# EAGLE design DrumMachine_Pic32_v1.2 (EAGLE 7.2.0)
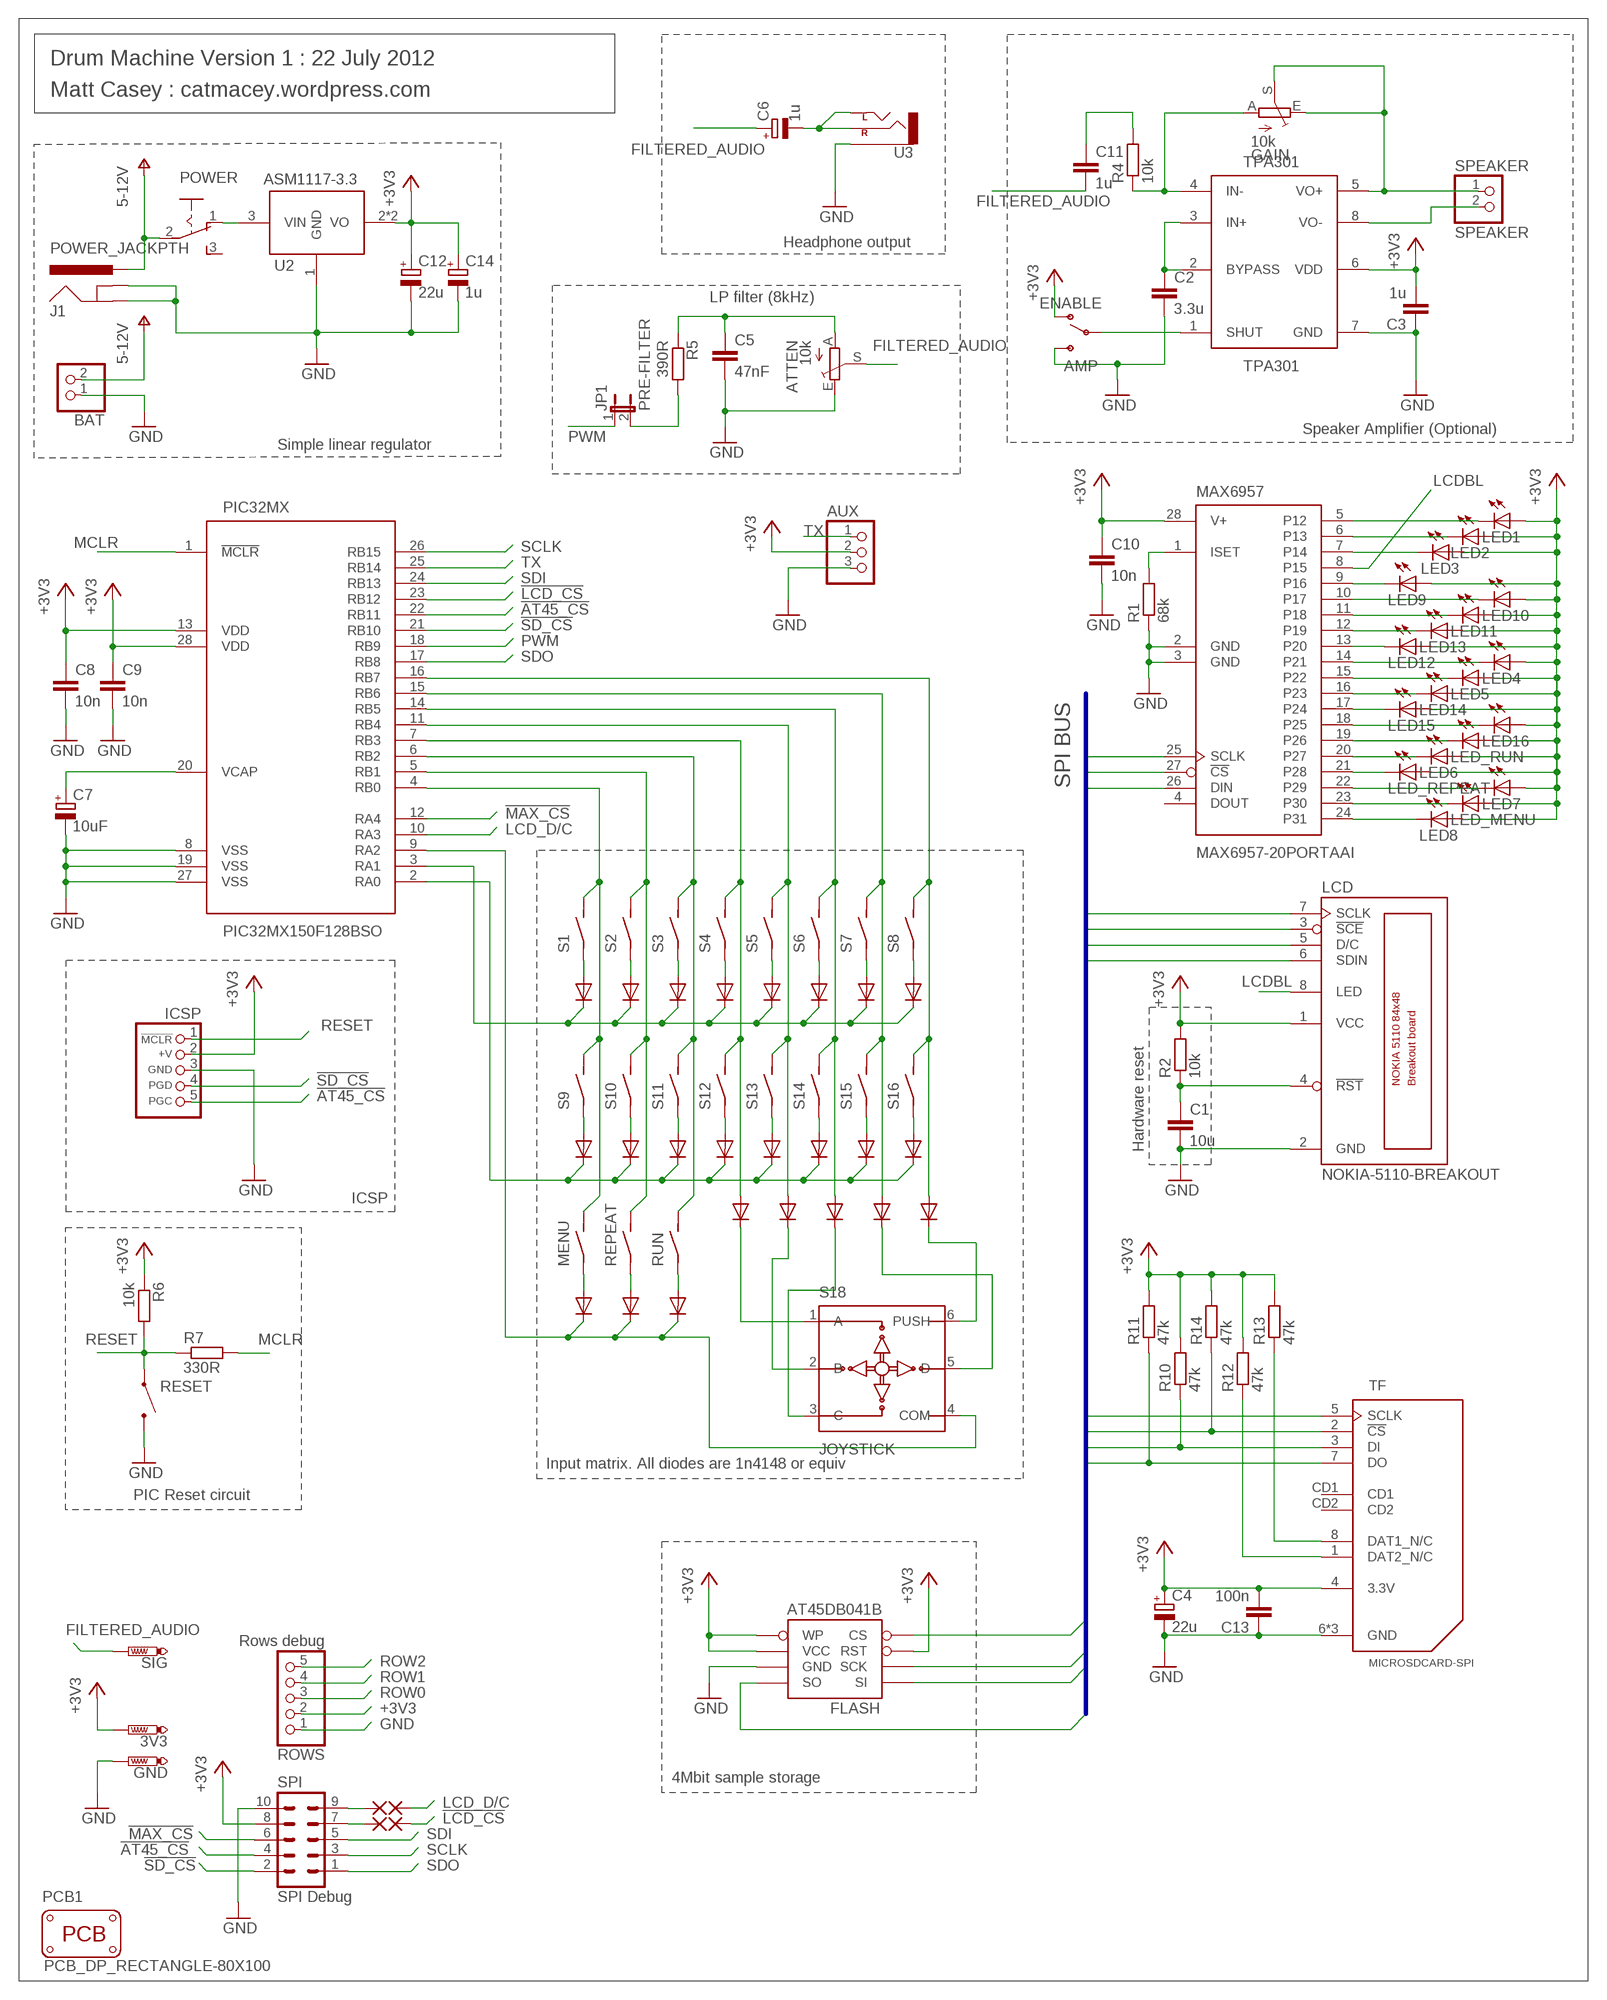
[diagram p0: schematic, sheet 1]

## Parts
3V3  PTR1PAD1-13  [P1-13]
AMP  ENABLE  SWITCH-SPST-SMD-A  [SWITCH-SPST-SMD-A]
ATTEN  10k  TRIM_EU-CA6V  [CA6V]
AUX  PINHD-1X3  [1X03]
BAT  PINHD-1X2  [1X02]
C1  10u  C-EUC0805  [C0805]
C2  3.3u  C-EUC0805  [C0805]
C3  1u  C-EUC0805  [C0805]
C4  22u  CPOL-EUSMCA  [SMC_A]
C5  47nF  C-EUC0805  [C0805]
C6  1u  CPOL-EU153CLV-0405  [153CLV-0405]
C7  10uF  CPOL-EUSMCA  [SMC_A]
C8  10n  C-EUC0805  [C0805]
C9  10n  C-EUC0805  [C0805]
C10  10n  C-EUC0805  [C0805]
C11  1u  C-EUC0805  [C0805]
C12  22u  CPOL-EUSMCA  [SMC_A]
C13  100n  C-EUC0805  [C0805]
C14  1u  CPOL-EU153CLV-0405  [153CLV-0405]
D1  DIODE-SOD-123  [SOD-123]
D2  DIODE-SOD-123  [SOD-123]
D3  DIODE-SOD-123  [SOD-123]
D4  DIODE-SOD-123  [SOD-123]
D5  DIODE-SOD-123  [SOD-123]
D6  DIODE-SOD-123  [SOD-123]
D7  DIODE-SOD-123  [SOD-123]
D8  DIODE-SOD-123  [SOD-123]
D9  DIODE-SOD-123  [SOD-123]
D10  DIODE-SOD-123  [SOD-123]
D11  DIODE-SOD-123  [SOD-123]
D12  DIODE-SOD-123  [SOD-123]
D13  DIODE-SOD-123  [SOD-123]
D14  DIODE-SOD-123  [SOD-123]
D15  DIODE-SOD-123  [SOD-123]
D16  DIODE-SOD-123  [SOD-123]
D17  DIODE-SOD-123  [SOD-123]
D18  DIODE-SOD-123  [SOD-123]
D19  DIODE-SOD-123  [SOD-123]
D20  DIODE-SOD-123  [SOD-123]
D21  DIODE-SOD-123  [SOD-123]
D22  DIODE-SOD-123  [SOD-123]
D23  DIODE-SOD-123  [SOD-123]
D25  DIODE-SOD-123  [SOD-123]
FLASH  AT45DB041B  [SO08]
GAIN  10k  TRIM_EU-CA6V  [CA6V]
GND  PTR1PAD1-13  [P1-13]
ICSP  CON_HEADER_PRG_PIC_ICSPB  [HEADER_PRG_1X05_ICSP_B]
J1  POWER_JACKPTH  [POWER_JACK_PTH]
JP1  PRE-FILTER  JP1E  [JP1]
LCD  NOKIA-5110-BREAKOUT  [NOKIA-5110-BREAKOUT]
LED1  LEDCHIPLED_0805  [CHIPLED_0805]
LED2  LEDCHIPLED_0805  [CHIPLED_0805]
LED3  LEDCHIPLED_0805  [CHIPLED_0805]
LED4  LEDCHIPLED_0805  [CHIPLED_0805]
LED5  LEDCHIPLED_0805  [CHIPLED_0805]
LED6  LEDCHIPLED_0805  [CHIPLED_0805]
LED7  LEDCHIPLED_0805  [CHIPLED_0805]
LED8  LEDCHIPLED_0805  [CHIPLED_0805]
LED9  LEDCHIPLED_0805  [CHIPLED_0805]
LED10  LEDCHIPLED_0805  [CHIPLED_0805]
LED11  LEDCHIPLED_0805  [CHIPLED_0805]
LED12  LEDCHIPLED_0805  [CHIPLED_0805]
LED13  LEDCHIPLED_0805  [CHIPLED_0805]
LED14  LEDCHIPLED_0805  [CHIPLED_0805]
LED15  LEDCHIPLED_0805  [CHIPLED_0805]
LED16  LEDCHIPLED_0805  [CHIPLED_0805]
LED_MENU  LEDCHIPLED_0805  [CHIPLED_0805]
LED_REPEAT  LEDCHIPLED_0805  [CHIPLED_0805]
LED_RUN  LEDCHIPLED_0805  [CHIPLED_0805]
MAX6957  MAX6957-20PORTAAI  [SSOP28]
MENU  ITT-PTS645SMD  [ITT-PTS645SMD]
P1  DEBUG_LCD_CS  1,6/0,81.2/0.5  [1,2/0,5]
P1A  LCD CS  1,6/0,81.2/0.5  [1,2/0,5]
P2  DEBUG_LCD_D/c  1,6/0,81.2/0.5  [1,2/0,5]
P2A  1,6/0,81.2/0.5  [1,2/0,5]
PCB1  PCB_DP_RECTANGLE-80X100  [DP10080_V1]
PIC32MX  PIC32MX150F128BSO  [SO-28]
POWER  DX_MINI_SPDT  [DX_MINI_SPDT_VERTICAL]
R1  68k  R-EU_R0805  [R0805]
R2  10k  R-EU_R0805  [R0805]
R4  10k  R-EU_R0805  [R0805]
R5  390R  R-EU_R0805  [R0805]
R6  10k  R-EU_R0805  [R0805]
R7  330R  R-EU_R0805  [R0805]
R10  47k  R-EU_R0805  [R0805]
R11  47k  R-EU_R0805  [R0805]
R12  47k  R-EU_R0805  [R0805]
R13  47k  R-EU_R0805  [R0805]
R14  47k  R-EU_R0805  [R0805]
REPEAT  ITT-PTS645SMD  [ITT-PTS645SMD]
RESET  TINY_TACTILESMD  [TINY_TACTILE_SMD]
ROWS  Rows debug  PINHD-1X5  [1X05]
RUN  ITT-PTS645SMD  [ITT-PTS645SMD]
S1  ITT-PTS645SMD  [ITT-PTS645SMD]
S2  ITT-PTS645SMD  [ITT-PTS645SMD]
S3  ITT-PTS645SMD  [ITT-PTS645SMD]
S4  ITT-PTS645SMD  [ITT-PTS645SMD]
S5  ITT-PTS645SMD  [ITT-PTS645SMD]
S6  ITT-PTS645SMD  [ITT-PTS645SMD]
S7  ITT-PTS645SMD  [ITT-PTS645SMD]
S8  ITT-PTS645SMD  [ITT-PTS645SMD]
S9  ITT-PTS645SMD  [ITT-PTS645SMD]
S10  ITT-PTS645SMD  [ITT-PTS645SMD]
S11  ITT-PTS645SMD  [ITT-PTS645SMD]
S12  ITT-PTS645SMD  [ITT-PTS645SMD]
S13  ITT-PTS645SMD  [ITT-PTS645SMD]
S14  ITT-PTS645SMD  [ITT-PTS645SMD]
S15  ITT-PTS645SMD  [ITT-PTS645SMD]
S16  ITT-PTS645SMD  [ITT-PTS645SMD]
S18  JOYSTICK  ALPS_SKQU_JOYSTICK  [ALPS_SKQU_JOYSTICK]
SIG  PTR1PAD1-13  [P1-13]
SPEAKER  SPEAKER  PINHD-1X2  [1X02]
SPI  SPI Debug  MA05-2  [MA05-2]
TF  MICROSDCARD-SPI  [TCF001_MICROSD_SOCKET]
TPA301  TPA301  [SO-08]
U2  ASM1117-3.3  [SOT223]
U3  AUDIO-JACKPTH  [STEREO_JACK3.5MM_PTH]

## Nets
!AT45_CS: FLASH.4(CS) ICSP.5(PGC) PIC32MX.22(RB11) SPI.4
!LCD_CS: LCD.3(!SCE) P1.1(P) P1A.1(P) PIC32MX.23(RB12) SPI.7
!LCDRST: C1.1 LCD.4(!RST) R2.1
!MAX_CS: MAX6957.27(!CS) PIC32MX.12(RA4) SPI.6
!SD_CS: ICSP.4(PGD) PIC32MX.21(RB10) R14.1 SPI.2 TF.2(!CS)
+3V3: 3V3.TP AMP.1(O) AUX.2 C3.2 C4.+ C8.1 C9.1 C10.1 C12.+ C13.2 C14.+ FLASH.3(RST) FLASH.5(WP) FLASH.6(VCC) ICSP.2(+V) LCD.1(VCC) LED1.A LED2.A LED3.A LED4.A LED5.A LED6.A LED7.A LED8.A LED9.A LED10.A LED11.A LED12.A LED13.A LED14.A LED15.A LED16.A LED_MENU.A LED_REPEAT.A LED_RUN.A MAX6957.28(V+) PIC32MX.13(VDD) PIC32MX.28(VDD) R2.2 R6.1 R10.2 R11.2 R12.2 R13.2 R14.2 ROWS.2 SPI.8 TF.4(3.3V) TPA301.6(VDD) U2.2(VO) U2.4(VO)
COL0: MENU.P$3 MENU.P$4 PIC32MX.4(RB0) S1.P$3 S1.P$4 S9.P$3 S9.P$4
COL1: PIC32MX.5(RB1) REPEAT.P$3 REPEAT.P$4 S2.P$3 S2.P$4 S10.P$3 S10.P$4
COL2: PIC32MX.6(RB2) RUN.P$3 RUN.P$4 S3.P$3 S3.P$4 S11.P$3 S11.P$4
COL3: D19.A PIC32MX.7(RB3) S4.P$3 S4.P$4 S12.P$3 S12.P$4
COL4: D20.A PIC32MX.11(RB4) S5.P$3 S5.P$4 S13.P$3 S13.P$4
COL5: D21.A PIC32MX.14(RB5) S6.P$3 S6.P$4 S14.P$3 S14.P$4
COL6: D22.A PIC32MX.15(RB6) S7.P$3 S7.P$4 S15.P$3 S15.P$4
COL7: D23.A PIC32MX.16(RB7) S8.P$3 S8.P$4 S16.P$3 S16.P$4
FILTERED_AUDIO: ATTEN.S C6.+ C11.2 SIG.TP
GND: AMP.3(S) ATTEN.E AUX.3 BAT.1 C1.2 C2.2 C3.1 C4.- C5.2 C7.- C8.2 C9.2 C10.2 C12.- C13.1 C14.- FLASH.7(GND) GND.TP ICSP.3(GND) J1.GND J1.GNDBREAK LCD.2(GND) MAX6957.2(GND) MAX6957.3(GND) PIC32MX.8(VSS) PIC32MX.19(VSS) PIC32MX.27(VSS) R1.1 RESET.2(B) ROWS.1 SPI.10 TF.6(GND) TF.P$11(GND) TF.P$12(GND) TPA301.7(GND) U2.1(GND) U3.S(SLEEVE) U3.S@1(SLEEVE)
LCD_D/C: LCD.5(D/C) P2.1(P) P2A.1(P) PIC32MX.10(RA3) SPI.9
LCDBL: LCD.8(LED) MAX6957.8(P15)
MCLR: PIC32MX.1(!MCLR) R7.2
N$1: D25.A S1.P$1 S1.P$2
N$2: D1.A S2.P$1 S2.P$2
N$3: D2.A S3.P$1 S3.P$2
N$4: D3.A S4.P$1 S4.P$2
N$5: D4.A S5.P$1 S5.P$2
N$6: D5.A S6.P$1 S6.P$2
N$7: D6.A S7.P$1 S7.P$2
N$8: D7.A S8.P$1 S8.P$2
N$9: LED1.C MAX6957.5(P12)
N$10: LED2.C MAX6957.6(P13)
N$11: LED3.C MAX6957.7(P14)
N$12: LED12.C MAX6957.13(P20)
N$13: LED11.C MAX6957.11(P18)
N$14: LED10.C MAX6957.10(P17)
N$15: LED9.C MAX6957.9(P16)
N$16: LED4.C MAX6957.14(P21)
N$17: LED13.C MAX6957.12(P19)
N$18: LED14.C MAX6957.16(P23)
N$19: LED15.C MAX6957.17(P24)
N$20: D18.A MENU.P$1 MENU.P$2
N$21: D17.A REPEAT.P$1 REPEAT.P$2
N$22: D16.A RUN.P$1 RUN.P$2
N$23: LED16.C MAX6957.18(P25)
N$24: D19.C S18.1(A)
N$25: D8.A S9.P$1 S9.P$2
N$26: LED5.C MAX6957.15(P22)
N$27: D9.A S10.P$1 S10.P$2
N$28: D10.A S11.P$1 S11.P$2
N$29: D11.A S12.P$1 S12.P$2
N$30: D12.A S13.P$1 S13.P$2
N$31: D13.A S14.P$1 S14.P$2
N$32: D14.A S15.P$1 S15.P$2
N$33: D15.A S16.P$1 S16.P$2
N$34: LED6.C MAX6957.20(P27)
N$35: D20.C S18.2(B)
N$36: D22.C S18.5(D)
N$37: D23.C S18.6(PUSH)
N$38: D21.C S18.3(C)
N$39: LED7.C MAX6957.22(P29)
N$40: LED8.C MAX6957.24(P31)
N$41: LED_RUN.C MAX6957.19(P26)
N$42: LED_REPEAT.C MAX6957.21(P28)
N$43: LED_MENU.C MAX6957.23(P30)
N$44: AMP.2(P) TPA301.1(SHUT)
N$45: MAX6957.1(ISET) R1.2
N$46: POWER.1(O) U2.3(VIN)
N$47: C2.1 TPA301.2(BYPASS) TPA301.3(IN+)
N$48: GAIN.E GAIN.S SPEAKER.1 TPA301.5(VO+)
N$49: C7.+ PIC32MX.20(VCAP)
N$50: GAIN.A R4.1 TPA301.4(IN-)
N$51: C11.1 R4.2
N$52: C6.- U3.L(LEFT) U3.L@1(LEFT) U3.R(RIGHT)
N$53: ATTEN.A C5.1 R5.1
N$55: R13.1 TF.8(DAT1_N/C)
N$59: R12.1 TF.1(DAT2_N/C)
N$60: SPEAKER.2 TPA301.8(VO-)
PWM: JP1.1 PIC32MX.18(RB9)
PWM2: JP1.2 R5.2
RESET: ICSP.1(/MCLR) R6.2 R7.1 RESET.1(A)
ROW0: D1.C D2.C D3.C D4.C D5.C D6.C D7.C D25.C PIC32MX.3(RA1) ROWS.3
ROW1: D8.C D9.C D10.C D11.C D12.C D13.C D14.C D15.C PIC32MX.2(RA0) ROWS.4
ROW2: D16.C D17.C D18.C PIC32MX.9(RA2) ROWS.5 S18.4(COM)
SCLK: FLASH.2(SCK) LCD.7(SCLK) MAX6957.25(SCLK) PIC32MX.26(RB15) SPI.3 TF.5(SCLK)
SDI: FLASH.8(SO) PIC32MX.24(RB13) R11.1 SPI.5 TF.7(DO)
SDO: FLASH.1(SI) LCD.6(SDIN) MAX6957.26(DIN) PIC32MX.17(RB8) R10.1 SPI.1 TF.3(DI)
TX: AUX.1 PIC32MX.25(RB14)
V+: BAT.2 J1.PWR POWER.2(P) ; supply symbol labelled 5-12V
Unconnected: MAX6957.4(DOUT) POWER.3(S) TF.CD1 TF.CD2

## Buses
SPI:SCLK,SDO,SDI,LCD_D/C,!LCD_CS,!MAX_CS,!SD_CS,!AT45_CS

## Notes on the sheet
- Drum Machine Version 1 : 22 July 2012
- Matt Casey : catmacey.wordpress.com
- Headphone output
- LP filter (8kHz)
- Speaker Amplifier (Optional)
- Simple linear regulator
- SPI BUS
- Hardware reset
- ICSP
- Input matrix. All diodes are 1n4148 or equiv
- PIC Reset circuit
- 4Mbit sample storage

## Library data of the parts
3V3 GND SIG = testpad:PTR1: TEST PIN
AMP = SparkFun:SWITCH-SPST: SPST Switch Simple slide switch. Spark Fun Electronics SKU : COM-00102
ATTEN GAIN = pot:TRIM_EU-: POTENTIOMETER
AUX = pinhead:PINHD-1X3: PIN HEADER
BAT SPEAKER = pinhead:PINHD-1X2: PIN HEADER
C1-C3 C5 C11 = rcl:C-EU: CAPACITOR, European symbol
C4 C6 C7 C12 C14 = rcl:CPOL-EU: POLARIZED CAPACITOR, European symbol
C8-C10 C13 = resistor:C-EU: CAPACITOR, European symbol
D1-D23 D25 = dp_devices:DIODE: Various Diode Packages
FLASH = SparkFun:AT45DB041B
ICSP = dp_devices:CON_HEADER_PRG_PIC_ICSP: 5-pin PIC In Circuit Serial Programming header
J1 = SparkFun:POWER_JACK: Power Jack This is the standard 5.5mm barrel jack for power. The PTH is the most common, proven, reliable, footprint. All others are experimental. The Slot footprint only works if the mill layer is transmitted to the PCB fab house so be warned. Spark Fun Electronics SKU : PRT-00119. Mating wall wart : TOL-00298 (and others)
JP1 = jumper:JP1E: JUMPER
LCD = Catmacey:NOKIA-5110-BREAKOUT
LED1-LED16 LED_MENU LED_REPEAT LED_RUN = led:LED: LED OSRAM: - CHIPLED LG R971, LG N971, LY N971, LG Q971, LY Q971, LO R971, LY R971 LH N974, LH R974 LS Q976, LO Q976, LY Q976 LO Q996 - Hyper CHIPLED LW Q18S LB Q993, LB Q99A, LB R99A - SideLED LS A670, LO A670, LY A670, LG A670, LP A670 LB A673, LV A673, LT A673, LW A673 LH A674 LY A675 LS A676, LA A676, LO A676, LY A676, LW A676 LS A679, LY A679, LG A679 - Hyper Micro SIDELED® LS Y876, LA Y876, LO Y876, LY Y876 LT Y87S - SmartLED LW L88C, LW L88S LB L89C, LB L89S, LG L890 LS L89K, LO L89K, LY L89K LS L896, LA L896, LO L896, LY L896 - TOPLED LS T670, LO T670, LY T670, LG T670, LP T670 LSG T670, LSP T670, LSY T670, LOP T670, LYG T670 LG T671, LOG T671, LSG T671 LB T673, LV T673, LT T673, LW T673 LH T674 LS T676, LA T676, LO T676, LY T676, LB T676, LH T676, LSB T676, LW T676 LB T67C, LV T67C, LT T67C, LS T67K, LO T67K, LY T67K, LW E67C LS E67B, LA E67B, LO E67B, LY E67B, LB E67C, LV E67C, LT E67C LW T67C LS T679, LY T679, LG T679 LS T770, LO T770, LY T770, LG T770, LP T770 LB T773, LV T773, LT T773, LW T773 LH T774 LS E675, LA E675, LY E675, LS T675 LS T776, LA T776, LO T776, LY T776, LB T776 LHGB T686 LT T68C, LB T68C - Hyper Mini TOPLED® LB M676 - Mini TOPLED Santana® LG M470 LS M47K, LO M47K, LY M47K Source: http://www.osram.convergy.de LUXEON: - LUMILED® LXK2-PW12-R00, LXK2-PW12-S00, LXK2-PW14-U00, LXK2-PW14-V00 LXK2-PM12-R00, LXK2-PM12-S00, LXK2-PM14-U00 LXK2-PE12-Q00, LXK2-PE12-R00, LXK2-PE12-S00, LXK2-PE14-T00, LXK2-PE14-U00 LXK2-PB12-K00, LXK2-PB12-L00, LXK2-PB12-M00, LXK2-PB14-N00, LXK2-PB14-P00, LXK2-PB14-Q00 LXK2-PR12-L00, LXK2-PR12-M00, LXK2-PR14-Q00, LXK2-PR14-R00 LXK2-PD12-Q00, LXK2-PD12-R00, LXK2-PD12-S00 LXK2-PH12-R00, LXK2-PH12-S00 LXK2-PL12-P00, LXK2-PL12-Q00, LXK2-PL12-R00 Source: www.luxeon.com KINGBRIGHT: KA-3528ASYC Source: www.kingbright.com
MAX6957 = Catmacey:MAX6957-20PORT: The MAX6957 <http://www.maxim-ic.com/datasheet/index.mvp/id/3365> is a compact, 4-wire (SPI) interfaced LED display driver general-purpose I/O (GPIO) peripheral provides microprocessors with up to 28 ports. Each port is individually user configurable to either a logic input, logic output, or common-anode (CA) LED constant-current segment driver. Each port configured as an LED segment driver behaves as a digitally controlled constantcurrent sink, with 16 equal current steps from 1.5mA to 24mA. The LED drivers are suitable for both discrete LEDs and CA numeric and alphanumeric LED digits. Each port configured as a GPIO can be either a push-pull logic output capable of sinking 10mA and sourcing 4.5mA, or a Schmitt logic input with optional internal pullup. Seven ports feature configurable transition detection logic, which generates an interrupt upon change of port logic level. The MAX6957 is controlled through an SPI™-compatible 4-wire serial interface. The MAX6957AAX and MAX6957ATL have 28 ports and are available in 36-pin SSOP and 40-pin TQFN (6mm x 6mm) packages, respectively. The MAX6957AAI and MAX6957ANI have 20 ports and are available in 28-pin SSOP and 28-pin DIP packages, respectively. For a 2-wire interfaced version, refer to the MAX6956 data sheet. For a lower cost pin-compatible port expander without the constant-current LED drive capability, refer to the MAX7301 data sheet. Key features High-Speed 26MHz SPI-/QSPI-™/MICROWIRE™-Compatible Serial Interface 2.5V to 5.5V Operation -40°C to +125°C Temperature Range 20 or 28 I/O Ports, Each Configurable as Constant-Current LED Driver Push-Pull Logic Output Schmitt Logic Input Schmitt Logic Input with Internal Pullup 11µA (max) Shutdown Current 16-Step Individually Programmable Current Control for Each LED Logic Transition Detection for Seven I/O Ports Underwriters Laboratories (UL) Recognized </qa/info/ul/>
MENU REPEAT RUN S1-S16 = Catmacey:ITT-PTS645: ITT SWITCH
P1 P1A P2 P2A = wirepad:1,6/0,8: THROUGH-HOLE PAD
PCB1 = dp_devices:PCB_DP_RECTANGLE: Dangerous Prototypes Standard Rectangular PCB sizes
PIC32MX = Catmacey:PIC32MX150F128B
POWER = Catmacey:DX_MINI_SPDT: SLIDING SWITCH SPDT Odd pin spacing 4.8mm bought from Deal Extreme Here <http://dx.com/p/3-pin-slide-switch-diy-parts-black-silver-20-piece-pack-134100?item=276>
R1 R2 R4-R7 R10-R14 = resistor:R-EU_: RESISTOR, European symbol
RESET = Catmacey:TINY_TACTILE: DIL/CODE SWITCH
ROWS = pinhead:PINHD-1X5: PIN HEADER
S18 = Catmacey:ALPS_SKQU_JOYSTICK: 4 way mini joystick with center push button ALPS Info page <http://www.alps.com/products/WebObjects/catalog.woa/E/HTML/Switch/Tact/SKQU/SKQUCAA010.html>
SPI = con-lstb:MA05-2: PIN HEADER; OC_FARNELL: unknown; OC_NEWARK: unknown
TF = Catmacey:MICROSDCARD-SPI
TPA301 = Catmacey:TPA301: TPA301 350-mW Mono Class-AB Audio Amplifier Info <http://www.ti.com/product/tpa301> The TPA301 is a bridge-tied load (BTL) audio power amplifier developed especially for low-voltage applications where internal speakers are required. Operating with a 3.3-V supply, the TPA301 can deliver 250-mW of continuous power into a BTL 8- load at less than 1% THD+N throughout voice band frequencies. Although this device is characterized out to 20 kHz, its operation was optimized for narrower band applications such as cellular communications. The BTL configuration eliminates the need for external coupling capacitors on the output in most applications, which is particularly important for small battery-powered equipment. This device features a shutdown mode for power-sensitive applications with a quiescent current of 0.15 µA during shutdown. The TPA301 is available in an 8-pin SOIC surface-mount package and the surface-mount PowerPAD MSOP, which reduces board space by 50% and height by 40%.
U2 = Catmacey:ASM1117-3.3: ICP006
U3 = Catmacey:AUDIO-JACK: 3.5mm Audio Jack Simple 3.5mm common PCB mount audio jack. SKU: PRT-08032

## Board
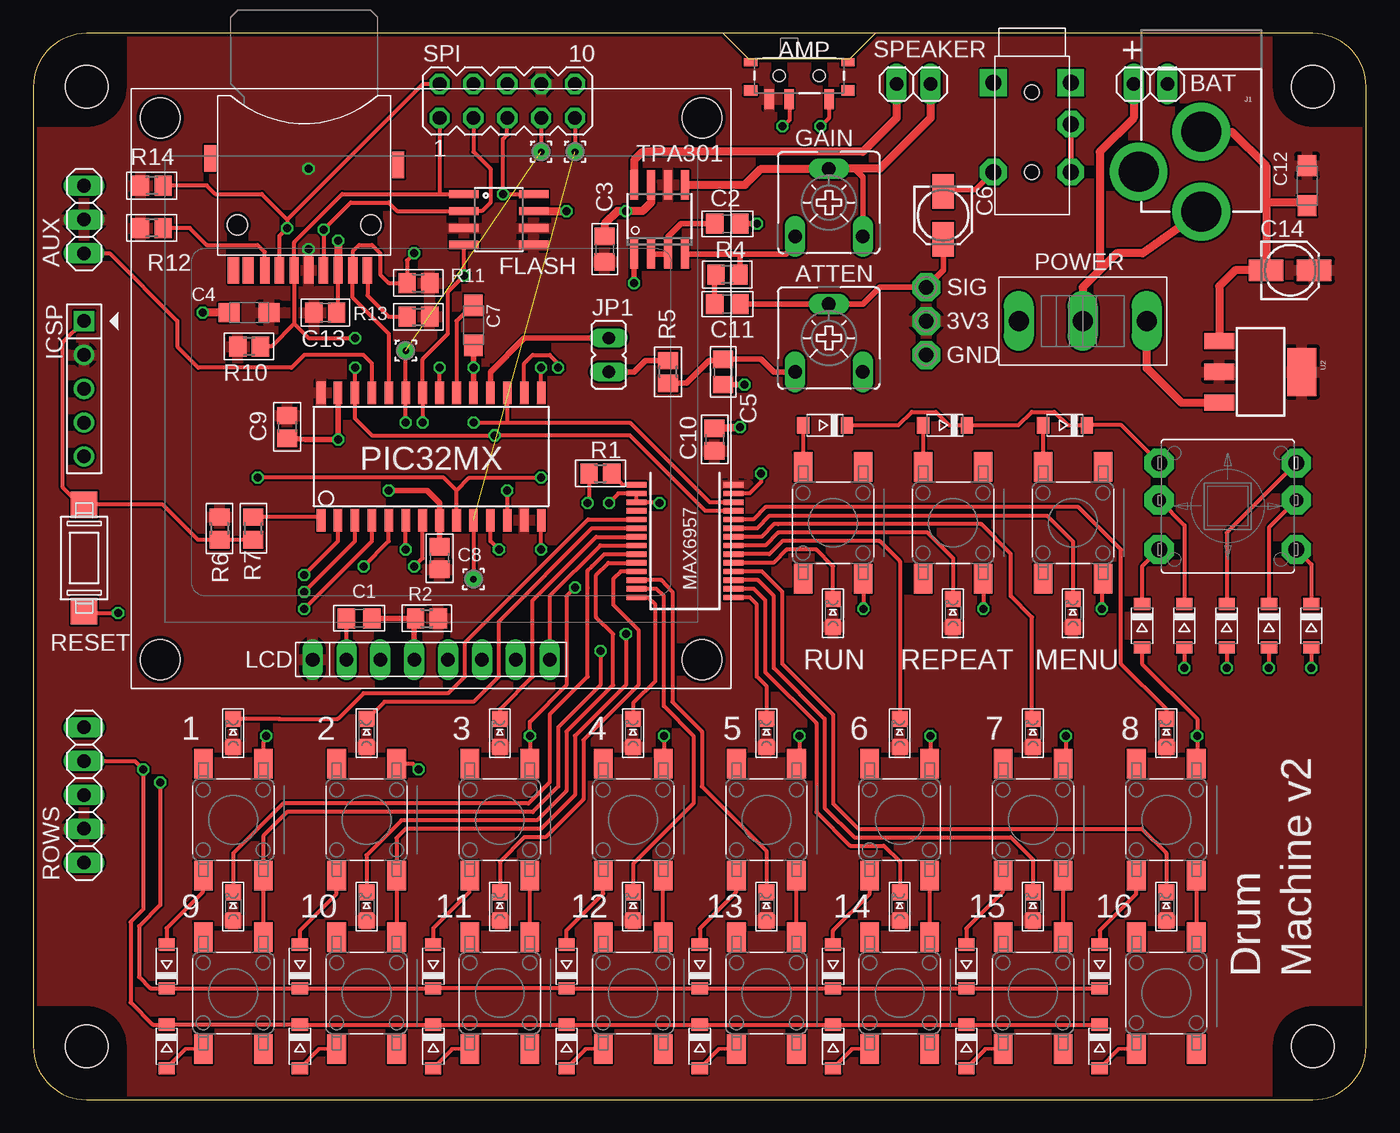
[diagram p1: board, top side]
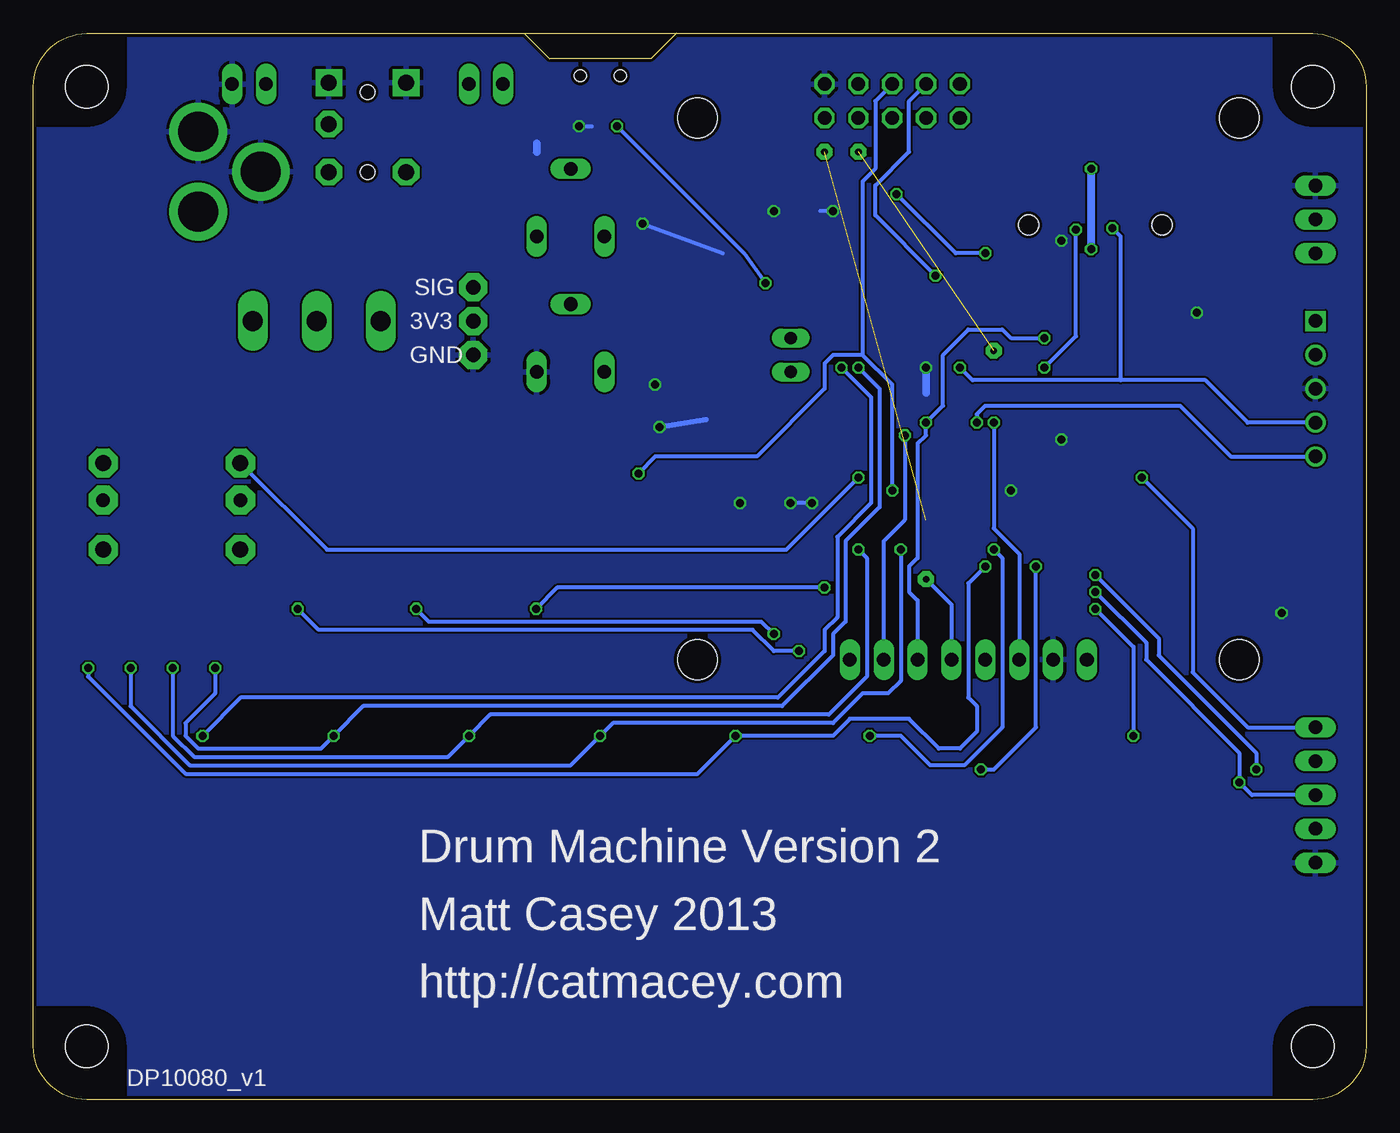
[diagram p2: board, bottom side, seen from below]

Size 100 x 80.01 mm. Coordinates in mm from the lower left corner, seen from the top.
Outline: 51.75,80.01 53.66,78.11 61.28,78.11 63.18,80.01
Copper layers (1*16): Top 0.035mm / dielectric 1.5mm / Bottom 0.035mm
Design rules "default": minimum track width 6mil, minimum drill 12mil, track to track 6mil, track to pad 6mil, pad to pad 6mil, via to via 6mil, smd to smd 0mil, copper to edge 10mil, drill to drill 10mil, minimum pad ring 10mil, minimum via ring 6mil, stop-mask expansion 2mil, vias tented up to drill 100mil, thermal gap 10mil

### Footprints (pad centres in the part's own frame; a part is rotated, then mirrored left to right if it is on the bottom)
P1-13 = drill 1.1 pad 2.1 octagon: TP 0,0
SWITCH-SPST-SMD-A = smd 0.7 x 1.5: 1 -2.25,-1.75; 2 -0.75,-1.75; 3 2.25,-1.75 | smd 1 x 0.6: GND1 -3.65,1; GND3 3.65,1 | smd 1 x 0.8: GND2 -3.65,-1.1; GND4 3.65,-1.1 | hole 0.9: -1.5,0; 1.5,0
CA6V = drill 1.016 long: A -2.54,-2.54; E 2.54,-2.54; S 0,2.54
1X03 = drill 1.016 long: 1 -2.54,0; 2 0,0; 3 2.54,0
1X02 = drill 1.016 long: 1 -1.27,0; 2 1.27,0
C0805 = smd 1.3 x 1.5: 1 -0.95,0; 2 0.95,0
SMC_A = smd 1.6 x 1.4: + -1.5,0; - 1.5,0
153CLV-0405 = smd 2.6 x 1.6: + 1.8,0; - -1.8,0
C0805' = smd 1.3 x 1.5: 1 -0.85,0; 2 0.85,0
SOD-123 = smd 0.91 x 1.22: A 1.635,0; C -1.635,0
SO08 = smd 0.61 x 2.21: 1 -1.905,-2.616; 2 -0.635,-2.616; 3 0.635,-2.616; 4 1.905,-2.616; 5 1.905,2.616; 6 0.635,2.616; 7 -0.635,2.616; 8 -1.905,2.616
HEADER_PRG_1X05_ICSP_B = drill 1.016 square: 1 -5.08,0 | drill 1.016: 2 -2.54,0; 3 0,0; 4 2.54,0; 5 5.08,0
POWER_JACK_PTH = drill 2.997 pad 4.318: GND 0,7.7; GNDBREAK 4.7,10.7; PWR 0,13.7
JP1 = drill 0.914 long: 1 0,-1.27; 2 0,1.27
NOKIA-5110-BREAKOUT = drill 1.016 long: 1 0,0; 2 2.54,0; 3 5.08,0; 4 7.62,0; 5 10.16,0; 6 12.7,0; 7 15.24,0; 8 17.78,0 | hole 3: -11.43,40.64; 29.21,40.64; -11.43,0; 29.21,0
CHIPLED_0805 = smd 1.2 x 1.2: A 0,-1.05; C 0,1.05
SSOP28 = smd 0.4 x 1.5: 1 -4.225,-3.625; 2 -3.575,-3.625; 3 -2.925,-3.625; 4 -2.275,-3.625; 5 -1.625,-3.625; 6 -0.975,-3.625; 7 -0.325,-3.625; 8 0.325,-3.625; 9 0.975,-3.625; 10 1.625,-3.625; 11 2.275,-3.625; 12 2.925,-3.625; 13 3.575,-3.625; 14 4.225,-3.625; 15 4.225,3.625; 16 3.575,3.625; 17 2.925,3.625; 18 2.275,3.625; 19 1.625,3.625; 20 0.975,3.625; 21 0.325,3.625; 22 -0.325,3.625; 23 -0.975,3.625; 24 -1.625,3.625; 25 -2.275,3.625; 26 -2.925,3.625; 27 -3.575,3.625; 28 -4.225,3.625
ITT-PTS645SMD = smd 2.2 x 1.4: P$1 -4.2,2.25; P$2 4.2,2.25; P$3 -4.2,-2.25; P$4 4.2,-2.25
1,2/0,5 = drill 0.5 pad 1.2 octagon: 1 0,0
DP10080_V1 = hole 3.2: 4,4; 96,4; 96,76; 4,76
SO-28 = smd 0.65 x 1.7: 1 -8.89,-4.78; 2 -7.62,-4.78; 3 -6.35,-4.78; 4 -5.08,-4.78; 5 -3.81,-4.78; 6 -2.54,-4.78; 7 -1.27,-4.78; 8 0,-4.78; 9 1.27,-4.78; 10 2.54,-4.78; 11 3.81,-4.78; 12 5.08,-4.78; 13 6.35,-4.78; 14 7.62,-4.78; 15 7.62,4.78; 16 6.35,4.78; 17 5.08,4.78; 18 3.81,4.78; 19 2.54,4.78; 20 1.27,4.78; 21 0,4.78; 22 -1.27,4.78; 23 -2.54,4.78; 24 -3.81,4.78; 25 -5.08,4.78; 26 -6.35,4.78; 27 -7.62,4.78; 28 -8.89,4.78
DX_MINI_SPDT_VERTICAL = drill 1.5 long: 1 -4.8,0; 2 0,0; 3 4.8,0
R0805 = smd 1.3 x 1.5: 1 -0.85,0; 2 0.85,0
TINY_TACTILE_SMD = smd 2 x 2: 1 0,4; 2 0,-4
1X05 = drill 1.016 long: 1 -5.08,0; 2 -2.54,0; 3 0,0; 4 2.54,0; 5 5.08,0
ALPS_SKQU_JOYSTICK = drill 1.2 pad 2.184 octagon: 1 -0.15,8.25; 3 -0.15,1.75; 4 10.15,1.75; 6 10.15,8.25 | drill 1 pad 2.184 octagon: 2 -0.15,4.55; 5 10.15,4.55
MA05-2 = drill 1.016 octagon: 1 -5.08,-1.27; 2 -5.08,1.27; 3 -2.54,-1.27; 4 -2.54,1.27; 5 0,-1.27; 6 0,1.27; 7 2.54,-1.27; 8 2.54,1.27; 9 5.08,-1.27; 10 5.08,1.27
TCF001_MICROSD_SOCKET = smd 0.7 x 2: 1 2.95,6.35; 2 1.85,6.35; 3 0.75,6.35; 4 -0.35,6.35; 5 -1.45,6.35; 6 -2.55,6.35; 7 -3.65,6.35; 8 -4.75,6.35 | smd 0.85 x 2: CD1 4.2,6.35; CD2 5.3,6.35 | smd 0.9 x 2: P$11 -7.05,-1.55; P$12 7.05,-2.05 | hole 1.5: -5,2.95; 5,2.95
SO-08 = smd 0.6 x 2.2: 1 -1.905,-2.6; 2 -0.635,-2.6; 3 0.635,-2.6; 4 1.905,-2.6; 5 1.905,2.6; 6 0.635,2.6; 7 -0.635,2.6; 8 -1.905,2.6
SOT223 = smd 1.219 x 2.235: 1 -2.311,-3.099; 2 0,-3.099; 3 2.311,-3.099 | smd 3.6 x 2.2: 4 0,3.099
STEREO_JACK3.5MM_PTH = drill 1.2 pad 2 octagon: L -2.9,-6.6; L@1 2.9,-6.6; R 2.9,-3 | drill 1.2 pad 2 square: S -2.9,0.1; S@1 2.9,0.1 | hole 1.1: 0,-6.6; 0,-0.6

### Placement (x,y rotation side)
3V3  66.99,58.42 0 top
AMP  57.47,76.83 0 top
ATTEN  59.69,57.15 0 top
AUX  3.81,66.04 90 top
BAT  83.82,76.2 180 top
C1  24.45,36.12 180 top
C2  52.07,65.72 0 top
C3  42.86,63.82 270 top
C4  16.19,59.05 180 top
C5  51.75,54.61 270 top
C6  68.26,66.36 270 top
C7  33.02,58.1 270 top
C8  10n  [C0805']  30.48,40.64 90 top
C9  10n  [C0805']  19.05,50.48 270 top
C10  10n  [C0805']  51.12,49.53 90 top
C11  52.07,59.69 0 top
C12  95.57,68.58 270 top
C13  100n  [C0805']  21.91,59.05 180 top
C14  94.3,62.23 0 top
D1  20,10 90 top
D2  30,10 90 top
D3  40,10 90 top
D4  50,10 90 top
D5  60,10 90 top
D6  70,10 90 top
D7  80,10 90 top
D8  10,4 270 top
D9  20,4 270 top
D10  30,4 270 top
D11  40,4 270 top
D12  50,4 270 top
D13  60,4 270 top
D14  70,4 270 top
D15  80,4 270 top
D16  59.4,50.6 180 top
D17  68.4,50.6 180 top
D18  77.4,50.6 180 top
D19  95.89,35.56 270 top
D20  92.71,35.56 270 top
D21  89.53,35.56 270 top
D22  86.36,35.56 270 top
D23  83.19,35.56 270 top
D25  10,10 90 top
FLASH  34.92,66.04 270 top
GAIN  59.69,67.31 0 top
GND  66.99,55.88 0 top
ICSP  3.81,53.34 270 top
J1  87.63,80.33 180 top
JP1  43.18,55.88 180 top
LCD  20.95,33.02 0 top
LED1  15,27.5 0 top
LED2  25,27.5 0 top
LED3  35,27.5 0 top
LED4  45,27.5 0 top
LED5  55,27.5 0 top
LED6  65,27.5 0 top
LED7  75,27.5 0 top
LED8  85,27.5 0 top
LED9  15,14.5 0 top
LED10  25,14.5 0 top
LED11  35,14.5 0 top
LED12  45,14.5 0 top
LED13  55,14.5 0 top
LED14  65,14.5 0 top
LED15  75,14.5 0 top
LED16  85,14.5 0 top
LED_MENU  78,36.5 0 top
LED_REPEAT  69,36.5 0 top
LED_RUN  60,36.5 0 top
MAX6957  48.9,41.91 270 top
MENU  78,43.28 90 top
P1  38.1,71.12 0 top
P1A  27.94,56.2 0 top
P2  40.64,71.12 0 top
P2A  33.02,39.05 0 top
PCB1  0,0 0 top
PIC32MX  30.48,48.26 0 top
POWER  78.74,58.42 180 top
R1  42.55,46.99 0 top
R2  29.53,36.12 0 top
R4  52.07,61.91 180 top
R5  47.62,54.61 90 top
R6  13.97,42.86 270 top
R7  16.51,42.86 90 top
R10  16.19,56.52 180 top
R11  28.89,61.28 0 top
R12  8.89,65.41 180 top
R13  28.89,58.74 0 top
R14  8.89,68.58 180 top
REPEAT  69,43.28 90 top
RESET  3.81,40.64 0 top
ROWS  3.81,22.86 90 top
RUN  60,43.28 90 top
S1  15,21 90 top
S2  25,21 90 top
S3  35,21 90 top
S4  45,21 90 top
S5  55,21 90 top
S6  65,21 90 top
S7  75,21 90 top
S8  85,21 90 top
S9  15,8 90 top
S10  25,8 90 top
S11  35,8 90 top
S12  45,8 90 top
S13  55,8 90 top
S14  65,8 90 top
S15  75,8 90 top
S16  85,8 90 top
S18  94.61,49.53 180 top
SIG  66.99,60.96 0 top
SPEAKER  66.04,76.2 180 top
SPI  35.56,74.93 0 top
TF  20.32,68.58 180 top
TPA301  46.99,66.04 0 top
U2  92.08,54.61 270 top
U3  74.93,76.2 0 top

### Tracks (layer width: path | path; a pad name or v marks a point on that pad's centre or on a via)
!AT45_CS  (via drill 0.6)
  Top 0.305: FLASH.4 v32.31,61.84 31.11,60.64 31.11,57.47 29.21,55.56 PIC32MX.22 v29.21,50.8
  Bottom 0.305: SPI.4 34.29,74.93 34.29,71.12 36.83,68.58 36.83,66.36 v32.31,61.84 | ICSP.5 10.16,48.26 13.97,52.07 28.57,52.07 29.21,51.44 v29.21,50.8
!LCD_CS  (via drill 0.6)  (1 unrouted)
  Top 0.305: v27.94,50.8 PIC32MX.23 P1A.1 | SPI.7 P1.1
  Bottom 0.305: v27.94,50.8 27.94,42.86 26.04,40.96 LCD.3
!LCDRST
  Top 0.406: LCD.4 28.57,36.12 | 28.57,36.12 R2.1 | 28.57,36.12 C1.1
!MAX_CS  (via drill 0.6)
  Top 0.305: v35.56,45.72 PIC32MX.12 | MAX6957.27 53.74,45.48 54.61,46.35 v54.61,46.99
  Bottom 0.305: v35.56,45.72 35.56,53.66 37.78,55.88 | 37.78,55.88 40.01,55.88 40.64,55.24 40.64,53.34 45.72,48.26 53.34,48.26 v54.61,46.99 | SPI.6 36.83,74.93 36.83,69.85 37.78,68.9 37.78,55.88
!SD_CS  (via drill 0.6)
  Top 0.305: R14.1 13.02,68.58 13.65,67.94 17.14,67.94 19.05,66.04 | PIC32MX.21 v30.48,54.93 | TF.2 18.47,64.83 v19.05,65.41 19.05,66.04 | SPI.2 29.21,76.2 19.05,66.04
  Bottom 0.305: v30.48,54.93 29.53,53.98 18.41,53.98 | v19.05,65.41 18.41,64.77 18.41,53.98 | ICSP.4 8.89,50.8 12.06,53.98 18.41,53.98
+3V3  (via drill 0.6)
  Top 0.61: TF.4 20.64,62.2 v20.64,63.82
  Bottom 0.61: v20.64,63.82 v20.64,69.85
  pour Top: 0,80.01 0,0 100.33,0 100.33,80.01
COL0  (via drill 0.6)
  Top 0.305: S9.P$4 S1.P$3 17.25,19.79 19.05,21.59 37.47,21.59 39.37,23.5 39.37,27.94 42.55,31.11 v42.55,33.66 | v20.32,36.83 25.4,41.91 PIC32MX.4 | 17.33,25.08 S1.P$4 17.25,26.77 v17.46,27.3 | MENU.P$3 80.18,39.21 v80.18,36.84
  Bottom 0.305: v20.32,36.83 17.46,33.97 v17.46,27.3 | v42.55,33.66 44.45,33.66 46.04,35.24 78.58,35.24 v80.18,36.84
COL1  (via drill 0.6)
  Top 0.305: S10.P$4 S2.P$3 27.25,19.63 27.94,20.32 38.1,20.32 40.64,22.86 40.64,27.3 44.45,31.11 v44.45,34.92 | v24.77,40.01 26.67,41.91 PIC32MX.5 | REPEAT.P$3 71.29,39.24 v71.29,36.84 | v28.89,24.77 28.46,25.2 S2.P$4
  Bottom 0.305: v28.89,24.77 27.94,24.77 24.77,27.94 v24.77,40.01 | v44.45,34.92 45.4,35.88 70.33,35.88 v71.29,36.84
COL2  (via drill 0.6)
  Top 0.305: S11.P$4 S3.P$3 | v40.64,38.42 40.01,37.78 40.01,31.11 37.25,28.36 v37.25,27.3 S3.P$4 37.25,24.45 36.93,24.45 | RUN.P$3 62.27,39.26 v62.27,36.84 | v27.94,41.27 PIC32MX.6
  Bottom 0.305: v27.94,41.27 27.3,40.64 27.3,27.94 30.16,25.08 32.7,25.08 34.92,27.3 v37.25,27.3 | v40.64,38.42 60.69,38.42 v62.27,36.84
COL3  (via drill 0.6)
  Top 0.305: S12.P$4 S4.P$3 | v28.57,40.01 29.21,40.64 PIC32MX.7 | v47.31,27.3 47.31,25.06 S4.P$4 | D19.A v95.89,32.38
  Bottom 0.305: v28.57,40.01 29.84,38.73 29.84,30.16 29.21,29.53 29.21,27.62 30.48,26.35 32.07,26.35 34.29,28.57 38.73,28.57 40.01,27.3 v47.31,27.3 50.16,24.45 88.58,24.45 95.89,31.75 v95.89,32.38
COL4  (via drill 0.6)
  Top 0.305: S13.P$4 S5.P$3 | v34.92,41.27 34.29,41.91 PIC32MX.11 | v57.47,27.3 57.47,25.22 S5.P$4 | D20.A v92.71,32.38
  Bottom 0.305: v34.92,41.27 34.92,31.43 35.88,30.48 37.78,30.48 40.01,28.26 56.52,28.26 v57.47,27.3 59.69,25.08 88.27,25.08 92.71,29.53 v92.71,32.38
COL5  (via drill 0.6)
  Top 0.305: S14.P$4 S6.P$3 | v67.31,27.3 67.31,25.06 S6.P$4 | D21.A v89.53,32.38 | v38.1,41.27 PIC32MX.14
  Bottom 0.305: v38.1,41.27 37.47,40.64 37.47,31.75 40.32,28.89 65.72,28.89 v67.31,27.3 68.9,25.72 87.95,25.72 89.53,27.3 v89.53,32.38
COL6  (via drill 0.6)
  Top 0.305: S7.P$3 S15.P$4 | 77.25,24.35 S7.P$4 77.47,25.22 v77.47,27.3 | D22.A v86.36,32.38 | PIC32MX.15 v38.1,54.93
  Bottom 0.305: v38.1,54.93 36.51,53.34 36.51,44.45 39.05,41.91 39.05,35.88 40.01,34.92 40.01,33.34 43.81,29.53 75.25,29.53 v77.47,27.3 78.42,26.35 87.63,26.35 88.58,27.3 88.58,28.26 86.36,30.48 v86.36,32.38
COL7  (via drill 0.6)
  Top 0.305: S8.P$3 S16.P$4 | v39.37,54.93 39.37,55.24 38.73,55.88 37.47,55.88 36.83,55.24 PIC32MX.16 | 87.25,25.02 S8.P$4 | S8.P$4 87.13,24.9 | S8.P$4 87.31,25.06 v87.31,27.3 87.31,28.57 83.19,32.7 D23.A
  Bottom 0.305: v39.37,54.93 37.15,52.7 37.15,44.77 39.69,42.23 39.69,36.2 40.64,35.24 40.64,33.66 44.13,30.16 84.45,30.16 v87.31,27.3
FILTERED_AUDIO
  Top 0.406: C11.2 ATTEN.S 62.23,59.69 63.5,60.96 SIG.TP 68.26,62.23 C6.+
GND  (via drill 0.6)
  Top 0.305: 22.77,62.13 TF.6 22.87,59.17 C13.1 | v43.18,44.77 43.9,45.48 MAX6957.2 MAX6957.3 46.99,44.84 v46.99,44.77 | R1.1 41.7,44.87 v41.59,44.77 | LCD.2 23.5,35.56 23.41,35.48 C1.2 | RESET.2 3.94,36.51 v6.35,36.51 | AMP.3 59.69,75.06 59.69,73.66 v59.05,73.03
  Top 0.406: C9.2 20.42,49.53 v22.86,49.53 PIC32MX.27 | v54.29,65.72 C2.2 | C5.2 v53.34,53.66 | C8.2 PIC32MX.8 30.48,44.77 29.53,45.72 v26.67,45.72 | C7.- v33.02,54.93 PIC32MX.19
  Top 0.61: TPA301.7 46.35,67.31 45.72,66.67 v44.45,66.67 43.81,66.67 42.86,65.72 C3.1 | FLASH.7 v40.01,66.67 | C4.- v12.7,59.05 | v22.86,64.45 v22.87,64.44 TF.6 | C10.2 v53.02,50.48 | J1.GND 89.93,72.63 92.5,70.06 92.5,67.31 | 92.5,67.31 C14.- 90.17,62.23 88.98,61.04 U2.1 | 95.34,67.31 92.5,67.31
  Top 0.813: C12.- 95.34,67.31
  Bottom 0.305: v54.29,65.72 48.26,63.5 | v40.01,66.67 40.96,66.67 | v41.59,44.77 42.86,44.77 43.18,44.45 | v59.05,73.03 58.1,73.03
  Bottom 0.406: v53.02,50.48 49.53,51.02
  Bottom 0.61: 62.23,71.75 62.23,71.12 | v33.02,54.93 PIC32MX.19
  pour Bottom: 0,80.01 99.69,80.01 99.69,0 0,0
LCD_D/C  (1 unrouted)
  Top 0.305: PIC32MX.10 P2A.1 | SPI.9 P2.1
  Bottom 0.305: P2A.1 31.11,37.15 LCD.5
LCDBL
  Top 0.305: LCD.8 38.73,37.78 42.54,41.59 MAX6957.8
MCLR
  Top 0.305: R7.2 21.59,43.71 PIC32MX.1
N$1
  Top 0.305: S1.P$1 12.7,17.05 12.7,15.56 10,12.86 D25.A
N$2
  Top 0.305: D1.A 20,12.7 22.75,15.45 S2.P$1
N$3
  Top 0.305: S3.P$1 32.7,17.05 32.7,15.56 30,12.86 D2.A
N$4
  Top 0.305: D3.A 40.01,12.7 42.75,15.45 S4.P$1
N$5
  Top 0.305: S5.P$1 52.7,17.05 52.7,15.56 50,12.85 D4.A
N$6
  Top 0.305: D5.A 60.01,11.64 60.01,12.7 62.75,15.44 S6.P$1
N$7
  Top 0.305: S7.P$1 72.71,17.06 72.71,15.56 70,12.85 D6.A
N$8
  Top 0.305: 82.55,16.9 S8.P$1 82.75,15.44 80,12.69 D7.A
N$9
  Top 0.305: 14.9,28.55 LED1.C 18.44,28.55 18.46,28.57 22.86,28.57 24.77,30.48 31.11,30.48 32.38,31.75 32.38,34.29 41.63,43.53 MAX6957.5
N$10
  Top 0.305: LED2.C 25.06,28.55 26.35,29.84 33.02,29.84 34.92,31.75 34.92,35.88 41.93,42.88 MAX6957.6
N$11
  Top 0.305: MAX6957.7 42.22,42.22 37.47,37.47 37.47,31.75 35,29.29 LED3.C 35.02,28.57
N$12
  Top 0.305: LED12.C 45,17.7 49.53,22.23 49.53,27.3 47.31,29.53 47.31,37.78 46.76,38.34 MAX6957.13
N$13
  Top 0.305: LED11.C 35,17.86 36.83,19.68 38.42,19.68 41.27,22.54 41.27,26.99 45.4,31.11 45.4,35.24 43.5,37.15 43.5,39.05 44.08,39.63 MAX6957.11
N$14
  Top 0.305: MAX6957.10 43.14,40.28 42.23,39.37 42.23,36.2 43.5,34.92 43.5,31.11 40.01,27.62 40.01,23.18 37.78,20.95 27.62,20.95 25,18.33 LED10.C
N$15
  Top 0.305: MAX6957.9 42.84,40.94 41.91,40.01 41.59,39.69 41.59,38.42 41.59,31.75 38.73,28.89 38.73,23.81 37.15,22.23 18.73,22.23 15,18.49 LED9.C
N$16
  Top 0.305: 45,28.49 LED4.C | 45.02,28.57 LED4.C | LED4.C 45,29.76 46.67,31.43 46.67,37.15 46.13,37.69 MAX6957.14
N$17
  Top 0.305: MAX6957.12 47.12,38.98 47.94,38.1 47.94,29.84 50.16,27.62 50.16,23.5 55,18.66 LED13.C
N$18
  Top 0.305: LED14.C 65,17.87 63.82,19.05 61.28,19.05 58.74,21.59 58.74,28.26 54.93,32.07 54.93,37.47 54.06,38.34 MAX6957.16
N$19
  Top 0.305: LED15.C 75,18.01 73.33,19.68 61.59,19.68 59.37,21.91 59.37,28.57 55.56,32.38 55.56,37.78 54.36,38.98 MAX6957.17
N$20
  Top 0.305: MENU.P$2 75.77,47.3 D18.A
N$21
  Top 0.305: REPEAT.P$2 66.77,47.3 D17.A
N$22
  Top 0.305: RUN.P$2 57.77,47.3 D16.A
N$23
  Top 0.305: LED16.C 85,18.5 83.19,20.32 61.91,20.32 60.01,22.23 60.01,28.89 56.2,32.7 56.2,38.1 54.66,39.63 MAX6957.18
N$24
  Top 0.305: S18.1 95.89,40.16 D19.C
N$25
  Top 0.305: S9.P$1 11.4,3.78 10.16,2.54
  Top 0.406: 10.16,2.54 10.16,2.52 D8.A
N$26
  Top 0.305: LED5.C 55,31.04 54.29,31.75 54.29,37.15 53.76,37.69 MAX6957.15
N$27
  Top 0.305: S10.P$1 21.42,3.78 D9.A
N$28
  Top 0.305: S11.P$1 31.42,3.78 D10.A
N$29
  Top 0.305: S12.P$1 41.42,3.78 D11.A
N$30
  Top 0.305: S13.P$1 51.42,3.78 D12.A
N$31
  Top 0.305: S14.P$1 61.42,3.78 D13.A
N$32
  Top 0.305: S15.P$1 71.42,3.78 D14.A
N$33
  Top 0.305: S16.P$1 81.42,3.78 D15.A
N$34
  Top 0.305: MAX6957.20 55.22,40.94 56.2,41.91 63.5,41.91 65,40.41 LED6.C
N$35
  Top 0.305: S18.2 92.71,42.92 D20.C
N$36
  Top 0.305: S18.5 86.36,43.09 D22.C
N$37
  Top 0.305: S18.6 83.19,40 D23.C
N$38
  Top 0.305: S18.3 89.53,42.55 D21.C
N$39
  Top 0.305: LED7.C 74.93,28.62 74.93,36.2 73.34,37.78 73.34,40.96 71.11,43.19 55.88,43.18 55.56,43.18 54.62,42.23 MAX6957.22
N$40
  Top 0.305: MAX6957.24 54.01,43.53 54.93,44.45 78.42,44.45 81.6,41.27 81.6,32.7 85,29.3 LED8.C
N$41
  Top 0.305: LED_RUN.C 60.01,40.01 58.74,41.27 56.52,41.27 55.52,40.28 MAX6957.19
N$42
  Top 0.305: LED_REPEAT.C 69,40.63 67.08,42.55 55.88,42.55 54.92,41.59 MAX6957.21
N$43
  Top 0.305: MAX6957.23 54.31,42.88 55.24,43.81 76.05,43.81 78,41.87 LED_MENU.C
N$44  (via drill 0.6)
  Top 0.305: AMP.2 56.72,73.46 v56.2,73.03
  Top 0.406: v45.09,61.28 45.02,63.5 TPA301.1
  Bottom 0.305: v56.2,73.03 46.67,63.5 v45.09,61.28
N$45
  Top 0.305: MAX6957.1 44.25,46.13 R1.2
N$46
  Top 0.61: U2.3 86.13,52.3 83.54,54.89 POWER.1
N$47
  Top 0.406: TPA301.2 TPA301.3 47.62,64.77 48.58,65.72 C2.1
N$48
  Top 0.406: GAIN.S 61.59,69.85 62.23,69.22 GAIN.E
  Top 0.61: TPA301.5 53.4,68.64 54.61,69.85 GAIN.S 63.5,69.85 67.31,73.66 SPEAKER.1
N$49
  Top 0.305: C7.+ 32.93,59.6 31.75,58.42 PIC32MX.20
N$50
  Top 0.406: GAIN.A 57.15,64.14 56.45,63.44 53.02,63.44 | 53.02,63.44 TPA301.4 | R4.1 53.02,62.02 53.02,63.44
N$51
  Top 0.406: R4.2 51.12,61.81 C11.1
N$52
  Top 0.406: U3.L@1 U3.R | C6.- 68.37,68.26 70.69,68.26 U3.L
N$53
  Top 0.406: ATTEN.A 55.56,54.61 54.61,55.56 53.02,55.56 C5.1 51.65,55.46 50.7,55.46 49,53.76 R5.1
N$55
  Top 0.305: TF.8 25.07,60.34 26.67,58.74 R13.1
N$59
  Top 0.305: TF.1 17.37,63.59 16.83,64.14 13.02,64.14 11.75,65.41 R12.1
N$60
  Top 0.61: TPA301.8 45.09,70.48 45.72,71.12 62.23,71.12 64.77,73.66 SPEAKER.2
PWM
  Top 0.406: JP1.1 36.83,57.15 34.29,54.61 PIC32MX.18
PWM2
  Top 0.406: JP1.2 45.09,54.61 45.94,55.46 R5.2
RESET
  Top 0.305: R7.1 R6.2 12.34,42.01 9.71,44.64 RESET.1 3.84,44.96 3.81,44.35 2.22,45.94 2.22,56.83 ICSP.1
ROW0  (via drill 0.6)
  Top 0.305: D7.C D6.C D5.C D4.C D3.C D2.C D1.C D25.C 8.78,8.37 7.94,9.21 7.94,13.02 9.53,14.61 v9.53,23.81 | v20.32,38.1 24.13,41.91 PIC32MX.3
  Bottom 0.305: v20.32,38.1 16.51,34.29 16.51,33.02 9.53,26.04 v9.53,23.81 8.57,22.86 ROWS.3
ROW1  (via drill 0.6)
  Top 0.305: D15.C D14.C D13.C D12.C D11.C D10.C D9.C D8.C 8.97,5.63 7.3,7.3 7.3,13.34 8.26,14.29 v8.26,24.77 7.62,25.4 ROWS.4 | v20.32,39.37 22.86,41.91 PIC32MX.2
  Bottom 0.305: v20.32,39.37 15.56,34.61 15.56,33.34 8.26,26.04 v8.26,24.77
ROW2  (via drill 0.6)
  Top 0.305: 31.75,45.72 32.7,46.67 v38.1,46.67 | 84.5,47.74 S18.4 81.64,50.6 D18.C 77.6,50.6 76.6,51.6 74.9,51.6 73.9,50.6 D17.C 68.7,50.6 67.7,51.6 65.9,51.6 64.9,50.6 D16.C | PIC32MX.9 31.75,45.72 | 31.75,45.72 30.8,46.67 v16.83,46.67
  Bottom 0.305: v38.1,46.67 43.5,41.27 77.96,41.27 S18.4 | v16.83,46.67 13.02,42.86 13.02,32.07 8.89,27.94 ROWS.5
SCLK  (via drill 0.6)
  Top 0.305: MAX6957.25 50.43,44.19 44.77,49.85 v34.61,49.85 25.4,49.85 24.13,51.12 PIC32MX.26 v24.13,54.93 | TF.5 21.77,64.91 v21.78,65.28 23.81,67.31 26.67,67.31 27.3,66.67 FLASH.2 33.66,66.67 34.29,67.31 34.29,69.85 33.02,71.12 SPI.3
  Bottom 0.305: LCD.7 36.2,41.91 34.61,43.5 v34.61,49.85 | v24.13,54.93 21.78,57.28 v21.78,65.28
SDI  (via drill 0.6)
  Top 0.305: FLASH.8 v35.24,67.94 35.24,72.07 35.56,72.39 SPI.5 | v28.57,63.5 28.04,62.97 R11.1 26.67,61.28 26.04,61.91 26.04,63.5 25.4,64.14 24.45,64.14 23.97,63.66 TF.7 23.97,60.17 26.67,57.47 PIC32MX.24
  Bottom 0.305: v28.57,63.5 30.8,63.5 v35.24,67.94
SDO  (via drill 0.6)
  Top 0.305: 19.57,58.22 TF.3 19.57,64.34 23.18,67.94 30.48,67.94 | 19.57,58.22 20.64,57.15 v24.13,57.15 | v33.02,50.8 35.56,50.8 | 35.56,50.8 44.77,50.8 50.73,44.84 MAX6957.26 | 19.57,58.22 17.87,56.52 R10.1 | 30.48,67.94 FLASH.1 | SPI.1 30.48,67.94 | PIC32MX.17 35.56,50.8
  Bottom 0.305: LCD.6 33.66,37.47 34.29,38.1 34.29,40.01 33.66,40.64 33.66,49.21 33.02,49.85 v33.02,50.8 31.75,52.07 31.75,55.88 29.84,57.78 27.3,57.78 26.67,57.15 v24.13,57.15
TX
  Top 0.305: AUX.1 5.71,63.5 10.79,58.42 10.79,56.52 12.38,54.93 19.37,54.93 20.32,55.88 24.77,55.88 25.4,55.24 PIC32MX.25 25.4,53.34
V+
  Top 0.61: J1.PWR 83.23,63.5 81.28,63.5 78.74,60.96 | 78.74,60.96 POWER.2 | BAT.2 82.55,73.66 80.01,71.12 80.01,62.23 78.74,60.96

### Text on the board
tPlace: + | RESET | 1 | 2 | 3 | 4 | 5 | 6 | 7 | 8 | 9 | 10 | 11 | 12 | 13 | 14 | 15 | 16 | Drum | Machine v2
bPlace: Drum Machine Version 2 | Matt Casey 2013 | http://catmacey.com
bNames: SIG | 3V3 | GND